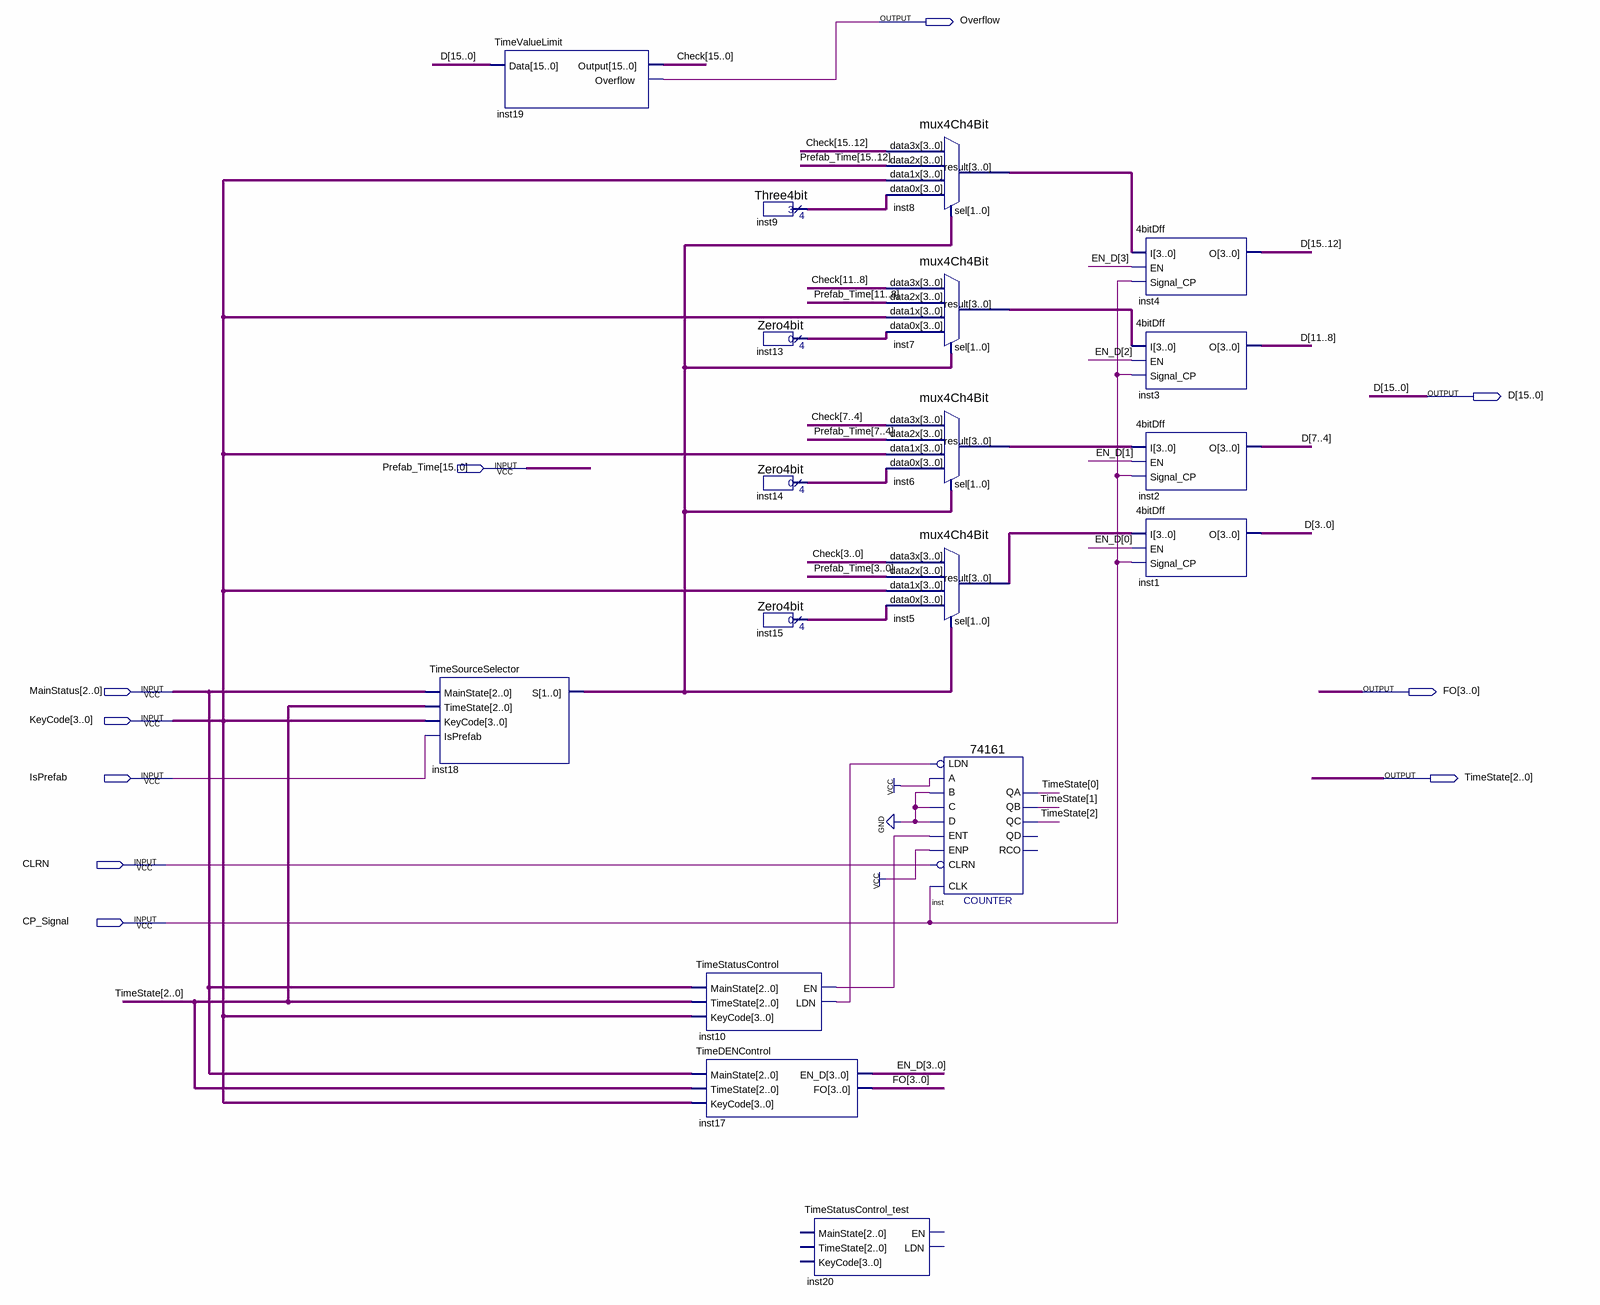
[diagram p0: schematic sheet]
// Quartus schematic TimeStatus_test.bdf as structural Verilog: 18 symbols, 10 pins
module TimeStatus_test (
  input  [15:0] Prefab_Time,
  input  [2:0] MainStatus,
  input  [3:0] KeyCode,
  input  IsPrefab,
  input  CLRN,
  input  CP_Signal,
  output Overflow,
  output [15:0] D,
  output [3:0] FO,
  output [2:0] TimeState
);

  wire inst10_en, inst10_ldn;
  wire [1:0] inst18_s;
  wire [3:0] EN_D, inst5_result, inst6_result, inst7_result, inst8_result, inst9_result, inst13_result,
       inst14_result, inst15_result;
  wire [15:0] Check;

  TimeSourceSelector inst18 (
    .MainState(MainStatus), .TimeState(TimeState), .KeyCode(KeyCode), .IsPrefab(IsPrefab), .S(inst18_s));
  TimeValueLimit inst19 (.Data(D), .Output(Check), .Overflow(Overflow));
  TimeStatusControl inst10 (
    .MainState(MainStatus), .TimeState(TimeState), .KeyCode(KeyCode), .EN(inst10_en), .LDN(inst10_ldn));
  TimeDENControl inst17 (.MainState(MainStatus), .TimeState(TimeState), .KeyCode(KeyCode), .EN_D(EN_D), .FO(FO));
  Three4bit inst9 (.result(inst9_result));
  Zero4bit inst13 (.result(inst13_result));
  Zero4bit inst14 (.result(inst14_result));
  Zero4bit inst15 (.result(inst15_result));
  TimeStatusControl_test inst20 ();  // open: MainState, TimeState, KeyCode, EN, LDN
  mux4Ch4Bit inst8 (
    .data3x(Check[15:12]), .data2x(Prefab_Time[15:12]), .data1x(KeyCode), .data0x(inst9_result),
    .sel(inst18_s), .result(inst8_result));
  mux4Ch4Bit inst7 (
    .data3x(Check[11:8]), .data2x(Prefab_Time[11:8]), .data1x(KeyCode), .data0x(inst13_result),
    .sel(inst18_s), .result(inst7_result));
  mux4Ch4Bit inst6 (
    .data3x(Check[7:4]), .data2x(Prefab_Time[7:4]), .data1x(KeyCode), .data0x(inst14_result), .sel(inst18_s),
    .result(inst6_result));
  mux4Ch4Bit inst5 (
    .data3x(Check[3:0]), .data2x(Prefab_Time[3:0]), .data1x(KeyCode), .data0x(inst15_result), .sel(inst18_s),
    .result(inst5_result));
  \74161  inst (
    .CLRN(CLRN), .CLK(CP_Signal), .ENP(1'b1), .LDN(inst10_ldn), .A(1'b1), .D(1'b0), .ENT(inst10_en),
    .B(1'b0), .C(1'b0), .QC(TimeState[2]), .QB(TimeState[1]), .QA(TimeState[0]));  // open: QD, RCO
  \4bitDff  inst4 (.I(inst8_result), .EN(EN_D[3]), .Signal_CP(CP_Signal), .O(D[15:12]));
  \4bitDff  inst3 (.I(inst7_result), .EN(EN_D[2]), .Signal_CP(CP_Signal), .O(D[11:8]));
  \4bitDff  inst2 (.I(inst6_result), .EN(EN_D[1]), .Signal_CP(CP_Signal), .O(D[7:4]));
  \4bitDff  inst1 (.I(inst5_result), .EN(EN_D[0]), .Signal_CP(CP_Signal), .O(D[3:0]));
endmodule
